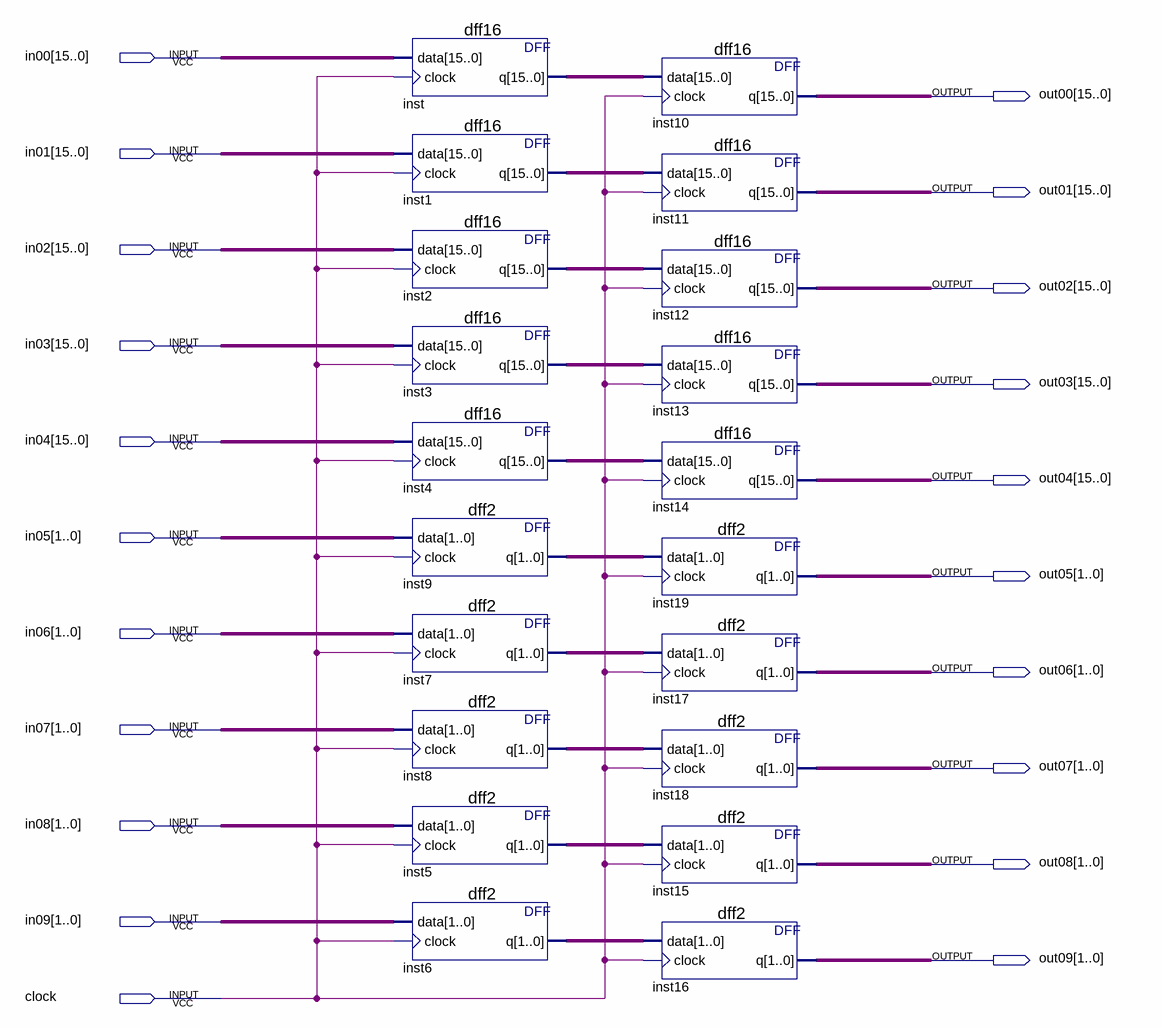
[diagram p0: schematic sheet]
// Quartus schematic Register_Set0.bdf as structural Verilog: 20 symbols, 21 pins
module Register_Set0 (
  input  [15:0] in00,
  input  [15:0] in01,
  input  [15:0] in02,
  input  [15:0] in03,
  input  [15:0] in04,
  input  [1:0] in05,
  input  [1:0] in06,
  input  [1:0] in07,
  input  [1:0] in08,
  input  [1:0] in09,
  input  clock,
  output [15:0] out00,
  output [15:0] out01,
  output [15:0] out02,
  output [15:0] out03,
  output [15:0] out04,
  output [1:0] out05,
  output [1:0] out06,
  output [1:0] out07,
  output [1:0] out08,
  output [1:0] out09
);

  wire [1:0] inst5_q, inst6_q, inst7_q, inst8_q, inst9_q;
  wire [15:0] inst1_q, inst2_q, inst3_q, inst4_q, inst_q;

  dff16 inst (.data(in00), .clock(clock), .q(inst_q));
  dff16 inst1 (.data(in01), .clock(clock), .q(inst1_q));
  dff16 inst2 (.data(in02), .clock(clock), .q(inst2_q));
  dff16 inst3 (.data(in03), .clock(clock), .q(inst3_q));
  dff16 inst4 (.data(in04), .clock(clock), .q(inst4_q));
  dff2 inst9 (.data(in05), .clock(clock), .q(inst9_q));
  dff2 inst7 (.data(in06), .clock(clock), .q(inst7_q));
  dff2 inst8 (.data(in07), .clock(clock), .q(inst8_q));
  dff2 inst5 (.data(in08), .clock(clock), .q(inst5_q));
  dff2 inst6 (.data(in09), .clock(clock), .q(inst6_q));
  dff16 inst10 (.data(inst_q), .clock(clock), .q(out00));
  dff16 inst11 (.data(inst1_q), .clock(clock), .q(out01));
  dff16 inst12 (.data(inst2_q), .clock(clock), .q(out02));
  dff16 inst13 (.data(inst3_q), .clock(clock), .q(out03));
  dff16 inst14 (.data(inst4_q), .clock(clock), .q(out04));
  dff2 inst19 (.data(inst9_q), .clock(clock), .q(out05));
  dff2 inst17 (.data(inst7_q), .clock(clock), .q(out06));
  dff2 inst18 (.data(inst8_q), .clock(clock), .q(out07));
  dff2 inst15 (.data(inst5_q), .clock(clock), .q(out08));
  dff2 inst16 (.data(inst6_q), .clock(clock), .q(out09));
endmodule
